# Altium project PCB_Project.PrjPcb
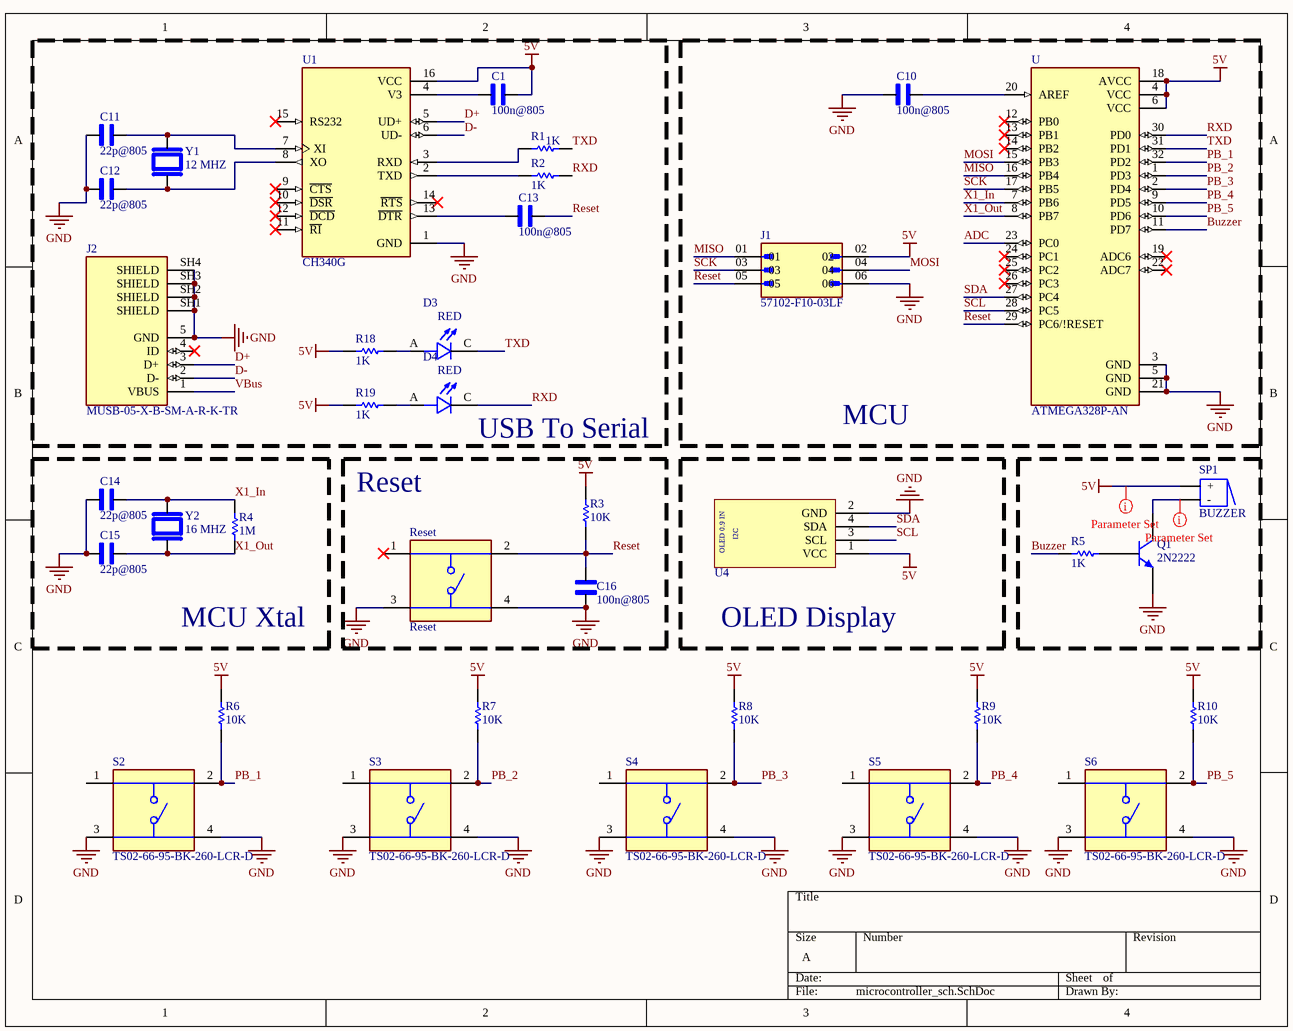
[diagram p0: microcontroller_sch.SchDoc]
2 sheets, 62 parts. Net scope: global (net labels, ports and power ports of the same name join across sheets).
Board file: PCB1.PcbDoc
Sheets:
  microcontroller_sch.SchDoc
  Power_sch.SchDoc

## Sheet microcontroller_sch.SchDoc
size A; SheetNumber: 1; SheetTotal: 2

### Parts
C1  100n@805  [CAPC2012X95N]
C10  100n@805  [CAPC2012X95N]
C11  22p@805  [CAPC2012X95N]
C12  22p@805  [CAPC2012X95N]
C13  100n@805  [CAPC2012X95N]
C14  22p@805  [CAPC2012X95N]
C15  22p@805  [CAPC2012X95N]
C16  100n@805  [CAPC2012X95N]
D3  7012X1  [LED_7012X1]  (value not drawn)
D4  7012X1  [LED_7012X1]  (value not drawn)
J1  57102-F10-03LF  [AMPHENOL_57102-F10-03LF]
J2  MUSB-05-X-B-SM-A-R-K-TR  [SAMTEC_MUSB-05-X-B-SM-A-R-K-TR]
Q1  2N2222  [2n2222 TO92]
R1  1K  [RES0805]
R2  1K  [RES0805]
R3  10K  [RES0805]
R4  1M  [RES0805]
R5  1K  [RES0805]
R6  10K  [RES0805]
R7  10K  [RES0805]
R8  10K  [RES0805]
R9  10K  [RES0805]
R10  10K  [RES0805]
R18  1K  [RES0805]
R19  1K  [RES0805]
Reset  Reset  [SW_TS02-66-95-BK-260-LCR-D]
S2  TS02-66-95-BK-260-LCR-D  [SW_TS02-66-95-BK-260-LCR-D]
S3  TS02-66-95-BK-260-LCR-D  [SW_TS02-66-95-BK-260-LCR-D]
S4  TS02-66-95-BK-260-LCR-D  [SW_TS02-66-95-BK-260-LCR-D]
S5  TS02-66-95-BK-260-LCR-D  [SW_TS02-66-95-BK-260-LCR-D]
S6  TS02-66-95-BK-260-LCR-D  [SW_TS02-66-95-BK-260-LCR-D]
SP1  BUZZER  [BUZZER 7.62 mm DC]
U  ATMEGA328P-AN  [QFP80P900X900X120-32N]
U1  CH340G  [SOIC127P600X180-16N]
U4  OLED SSD1306 I2C  [OLED_SSD1306_64_I2C]  (value not drawn)
Y1  12 MHZ  [XTAL_HC49P488W46L1150T500H350]
Y2  16 MHZ  [XTAL_HC49P488W46L1150T500H350]

### Blocks framed on the sheet
USB To Serial: C1 C11-C13 D3 D4 J2 R1 R2 R18 R19 U1 Y1
MCU: C10 J1 U
MCU Xtal: C14 C15 R4 Y2
OLED Display: U4

### Nets
5V: C1.2 J1.02 R3.2 R6.2 R7.2 R8.2 R9.2 R10.2 R18.2 R19.2 SP1.1(+) U.4(VCC) U.6(VCC) U.18(AVCC) U1.16(VCC) U4.1(VCC)
GND: C10.1 C11.1 C12.1 C14.1 C15.1 C16.1 J1.06 J2.5(GND) J2.SH1(SHIELD) J2.SH2(SHIELD) J2.SH3(SHIELD) J2.SH4(SHIELD) Q1.3(E) Reset.3 Reset.4 S2.3 S2.4 S3.3 S3.4 S4.3 S4.4 S5.3 S5.4 S6.3 S6.4 U.3(GND) U.5(GND) U.21(GND) U1.1(GND) U4.2(GND)
ADC: U.23(PC0)
Buzzer: R5.2 U.11(PD7)
D+: J2.3(D+) U1.5(UD+)
D-: J2.2(D-) U1.6(UD-)
MISO: J1.01 U.16(PB4)
MOSI: J1.04 U.15(PB3)
PB_1: R6.1 S2.2 U.32(PD2)
PB_2: R7.1 S3.2 U.1(PD3)
PB_3: R8.1 S4.2 U.2(PD4)
PB_4: R9.1 S5.2 U.9(PD5)
PB_5: R10.1 S6.2 U.10(PD6)
Reset: C13.2 C16.2 J1.05 R3.1 Reset.2 U.29(PC6/!RESET)
RXD: D4.C R2.1 U.30(PD0)
SCK: J1.03 U.17(PB5)
SCL: U.28(PC5) U4.3(SCL)
SDA: U.27(PC4) U4.4(SDA)
TXD: D3.C R1.1 U.31(PD1)
VBus: J2.1(VBUS)
X1_In: C14.2 R4.2 U.7(PB6) Y2.1
X1_Out: C15.2 R4.1 U.8(PB7) Y2.2
NetC1_1: C1.1 U1.4(V3)
NetC10_2: C10.2 U.20(AREF)
NetC11_2: C11.2 U1.7(XI) Y1.1
NetC12_2: C12.2 U1.8(XO) Y1.2
NetC13_1: C13.1 U1.13(~{DTR})
NetD3_A: D3.A R18.1
NetD4_A: D4.A R19.1
NetQ1_1: Q1.1(B) R5.1
NetQ1_2: Q1.2(C) SP1.2(-)
NetR1_2: R1.2 U1.3(RXD)
NetR2_2: R2.2 U1.2(TXD)

Not connected (* = marked no-connect by the designer): J2 4(ID)*; Reset 1*; S2 1; S3 1; S4 1; S5 1; S6 1; U 12(PB0)* 13(PB1)* 14(PB2)* 19(ADC6)* 22(ADC7)* 24(PC1)* 25(PC2)* 26(PC3)*; U1 9(~{CTS})* 10(~{DSR})* 11(~{RI})* 12(~{DCD})* 14(~{RTS})* 15(RS232)*

### Layout directives
rule Width Constraint [Pref Width = 0.5mm    Min Width = 0.4mm    Max Width = 0.6mm]: 5V, NetQ1_2

### Notes on the sheet
- Reset
- (in symbol 7012X1) RED
- (in symbol OLED SSD1306 I2C) I2C; OLED 0.9 IN

### Library data of the parts
C1 C10-C16 = AC0805KPX7R9BB103: Multilayer Ceramic Capacitors MLCC - SMD/SMT 50Vol 0.01uF X7R 805 10% AEC-Q200; MF: YAGEO; SnapEDA_Link: https://www.snapeda.com/parts/AC0805KPX7R9BB103/Yageo/view-part/?ref=snap; Package: 0805 Yageo; Value: *; MP: AC0805KPX7R9BB103; Check_prices: https://www.snapeda.com/parts/AC0805KPX7R9BB103/Yageo/view-part/?ref=eda
D3 D4 = 7012X1: Red - LED Indication - Discrete 1.7V 0805 (2012 Metric); MF: VCC; Package: 0805 Visual Communications; Purchase-URL: https://pricing.snapeda.com/search/part/7012X1/?ref=eda; MP: 7012X1; Value: *; Availability: In Stock; SnapEDA_Link: https://www.snapeda.com/parts/7012X1/Visual+Communications/view-part/?ref=snap; Price: None; Check_prices: https://www.snapeda.com/parts/7012X1/Visual+Communications/view-part/?ref=eda
J1 = 57102-F10-03LF: Header, Through Hole, Double row, 6, 2mm (0.079in), Vertical; MF: Amphenol ICC (FCI); Check_prices: https://www.snapeda.com/parts/57102-F10-03LF/Amphenol+FCI/view-part/?ref=eda; Price: None; Availability: In Stock; SnapEDA_Link: https://www.snapeda.com/parts/57102-F10-03LF/Amphenol+FCI/view-part/?ref=snap; Value: *; MP: 57102-F10-03LF; Package: None; Purchase-URL: https://pricing.snapeda.com/search/part/57102-F10-03LF/?ref=eda
J2 = MUSB-05-X-B-SM-A-R-K-TR: USB - mini B USB 2.0 Receptacle Connector 5 Position Surface Mount, Right Angle; MF: Samtec; MP: MUSB-05-F-B-SM-A-R-K-TR; SnapEDA_Link: https://www.snapeda.com/parts/MUSB-05-F-B-SM-A-R-K-TR/Samtec/view-part/?ref=snap; Package: None; Value: *; Check_prices: https://www.snapeda.com/parts/MUSB-05-F-B-SM-A-R-K-TR/Samtec/view-part/?ref=eda
Q1 = 2N2222: npn
R1-R10 R18 R19 = RES0805
Reset = TS02-66-95-BK-260-LCR-D: Price: None; Availability: Unavailable; MP: TS02-66-95-BK-260-LCR-D; Value: *; Package: None
U = ATMEGA328P-AN: AVR AVRÂ® ATmega Microcontroller IC 8-Bit 20MHz 32KB _16K x 16_ FLASH 32-TQFP _7x7_; MF: Microchip; SnapEDA_Link: https://www.snapeda.com/parts/ATMEGA328P-AN/Microchip/view-part/1227245/?ref=snap; Value: *; MP: ATMEGA328P-AN; Package: TQFP-32 Microchip; Price: None; Availability: Unavailable
U1 = CH340G: USB Interface Integrated Circuit; MF: WCH; Value: *; SnapEDA_Link: https://www.snapeda.com/parts/Ch340G/WCH/view-part/?ref=snap; MP: Ch340G; Check_prices: https://www.snapeda.com/parts/Ch340G/WCH/view-part/?ref=eda; Availability: Not in stock; Price: None; Package: None
U4 = OLED SSD1306 I2C: OLED, SSD1306, 0.96", 128X64, BREAKOUT I2C; DatasheetVersion: 2022; ComponentLink2Description: WebSite: pcblearn; ComponentLink2URL: www.pcblearn.com
Y1 Y2 = ABL-22.1184MHZ-B2: HC/49US (AT49) MICROPROCESSOR CRYSTAL; MF: Abracon LLC; Purchase-URL: https://pricing.snapeda.com/search/part/ABL-22.1184MHZ-B2/?ref=eda; Check_prices: https://www.snapeda.com/parts/ABL-22.1184MHZ-B2/Abracon+LLC/view-part/?ref=eda; Value: *; Package: HC-49/US ABRACON; Price: None; Availability: In Stock; MP: ABL-22.1184MHZ-B2; SnapEDA_Link: https://www.snapeda.com/parts/ABL-22.1184MHZ-B2/Abracon+LLC/view-part/?ref=snap
S2-S6 = TS02-66-95-BK-260-LCR-D: Price: None; Availability: Unavailable; MP: TS02-66-95-BK-260-LCR-D; Value: *; Package: None

## Sheet Power_sch.SchDoc
size A; SheetNumber: 2; SheetTotal: 2
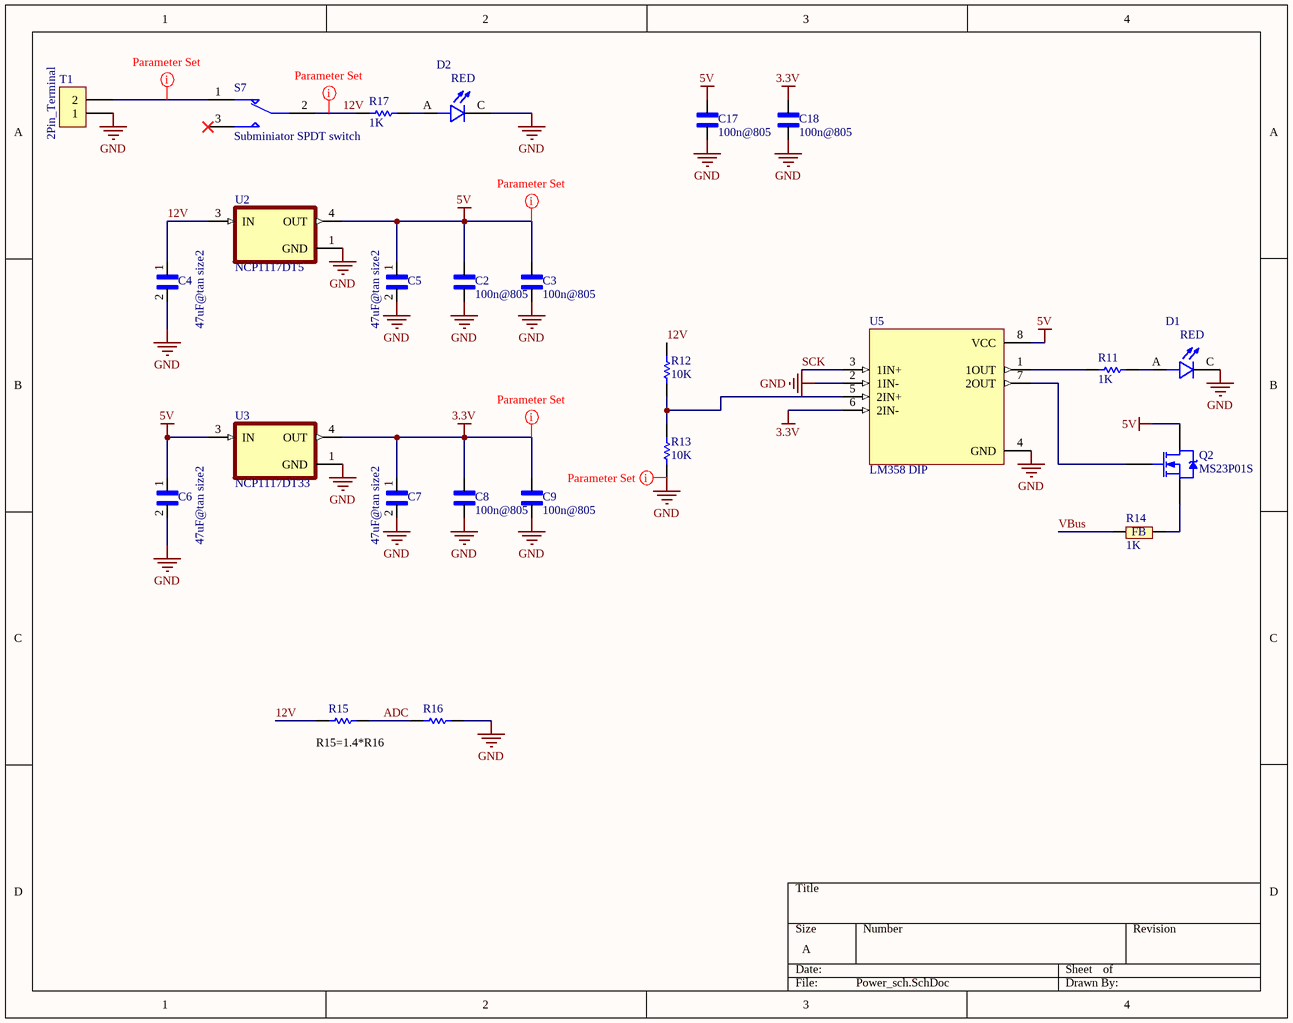
[diagram p1: Power_sch.SchDoc]

### Parts
C2  100n@805  [CAPC2012X95N]
C3  100n@805  [CAPC2012X95N]
C4  47uF@tan size2  [CAPC2012X140N]
C5  47uF@tan size2  [CAPC2012X140N]
C6  47uF@tan size2  [CAPC2012X140N]
C7  47uF@tan size2  [CAPC2012X140N]
C8  100n@805  [CAPC2012X95N]
C9  100n@805  [CAPC2012X95N]
C17  100n@805  [CAPC2012X95N]
C18  100n@805  [CAPC2012X95N]
D1  7012X1  [LED_7012X1]  (value not drawn)
D2  7012X1  [LED_7012X1]  (value not drawn)
Q2  MS23P01S  [IRF640N TO-220AB]
R11  1K  [RES0805]
R12  10K  [RES0805]
R13  10K  [RES0805]
R14  1K  [RES0805]
R15  2.2K  [RES0805]  (value not drawn)
R16  10K  [RES0805]  (value not drawn)
R17  1K  [RES0805]
S7  Subminiator SPDT switch  [Subminiator SPDT switch]
T1  2Pin_Terminal  [2Pin_Terminal]
U2  NCP1117DT5  [VREG_NCP1117DT33]
U3  NCP1117DT33  [VREG_NCP1117DT33]
U5  LM358 DIP  [LM358 DIP]

### Nets
3.3V: C7.1 C8.2 C9.2 C18.2 U3.4(OUT) U5.6(2IN-)
5V: C2.2 C3.2 C5.1 C6.1 C17.2 Q2.3(D) U2.4(OUT) U3.3(IN) U5.8(VCC)
GND: C2.1 C3.1 C4.2 C5.2 C6.2 C7.2 C8.1 C9.1 C17.1 C18.1 D1.C D2.C R13.1 R16.1 T1.1 U2.1(GND) U3.1(GND) U5.2(1IN-) U5.4(GND)
12V: C4.1 R12.2 R15.2 R17.2 S7.2 U2.3(IN)
ADC: R15.1 R16.2
SCK: U5.3(1IN+)
VBus: R14.1
NetD1_A: D1.A R11.1
NetD2_A: D2.A R17.1
NetQ2_1: Q2.1(G) U5.7(2OUT)
NetQ2_2: Q2.2(S) R14.2
NetR11_2: R11.2 U5.1(1OUT)
NetR12_1: R12.1 R13.2 U5.5(2IN+)
NetS7_1: S7.1 T1.2

Not connected (* = marked no-connect by the designer): S7 3*

### Layout directives
rule Width Constraint [Pref Width = 0.5mm    Min Width = 0.4mm    Max Width = 0.6mm]: 3.3V, 5V, 12V, GND, NetS7_1

### Notes on the sheet
- (near R15) R15=1.4*R16
- (in symbol 7012X1) RED
- (in symbol RES1206) FB

### Library data of the parts
C2 C3 C8 C9 C17 C18 = AC0805KPX7R9BB103: as C1 on sheet microcontroller_sch; SnapEDA_Link: https://www.snapeda.com/parts/AC0805KPX7R9BB103/Yageo/view-part/?ref=snap; Package: 0805 Yageo; Value: *; MP: AC0805KPX7R9BB103; Check_prices: https://www.snapeda.com/parts/AC0805KPX7R9BB103/Yageo/view-part/?ref=eda
C4-C7 = TLJR476M010S3200: Tantalum Capacitors; MF: AVX; Price: None; Availability: Unavailable; Value: *; MP: TLJR476M010S3200; Check_prices: https://www.snapeda.com/parts/TLJR476M010S3200/AVX/view-part/1709907/?ref=eda; SnapEDA_Link: https://www.snapeda.com/parts/TLJR476M010S3200/AVX/view-part/1709907/?ref=snap; Package: 0805 AVX
D1 D2 = 7012X1: as D3 on sheet microcontroller_sch; Package: 0805 Visual Communications; Purchase-URL: https://pricing.snapeda.com/search/part/7012X1/?ref=eda; MP: 7012X1; Value: *; Availability: In Stock; SnapEDA_Link: https://www.snapeda.com/parts/7012X1/Visual+Communications/view-part/?ref=snap; Price: None; Check_prices: https://www.snapeda.com/parts/7012X1/Visual+Communications/view-part/?ref=eda
Q2 = IRF640N
R11-R13 R15-R17 = RES0805
R14 = RES1206
U2 U3 = NCP1117DT33: Linear Voltage Regulator IC Positive Fixed 1 Output 1A DPAK; MF: ON Semiconductor; Price: None; Value: *; Availability: In Stock; Check_prices: https://www.snapeda.com/parts/NCP1117DT33/Onsemi/view-part/?ref=eda; SnapEDA_Link: https://www.snapeda.com/parts/NCP1117DT33/Onsemi/view-part/?ref=snap; Purchase-URL: https://pricing.snapeda.com/search/part/NCP1117DT33/?ref=eda; MP: NCP1117DT33; Package: DPAK-3 ON Semiconductor
U5 = LM358 DIP: Dual Operational Amplifiers; MP: LM358P; MF: Texas Instruments; Package: PDIP-8 Texas Instruments; DigiKey-Purchase-URL: https://snapeda.com/shop?store=DigiKey&id=559457; Arrow_Electronics-Purchase-URL: https://snapeda.com/shop?store=Arrow+Electronics&id=559457; Price: None; Texas_Instruments-Purchase-URL: https://snapeda.com/shop?store=Texas+Instruments&id=559457; Value: *; Availability: Unavailable; SnapEDA_Link: https://www.snapeda.com/parts/LM358P/Texas%20Instruments/view-part/559457/?ref=snap; Mouser-Purchase-URL: https://snapeda.com/shop?store=Mouser&id=559457

## Nets that join several sheets
5V: microcontroller_sch (16 pins), Power_sch (9 pins)
GND: microcontroller_sch (30 pins), Power_sch (19 pins)
ADC: microcontroller_sch (U.23), Power_sch (R15.1 R16.2)
SCK: microcontroller_sch (J1.03 U.17), Power_sch (U5.3)
VBus: microcontroller_sch (J2.1), Power_sch (R14.1)